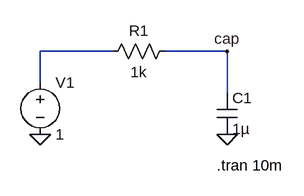
[diagram p0: schematic RC CIRCUIT.asc]
RC CIRCUIT.asc, the LTspice schematic file:
Version 4.1
SHEET 1 880 680
WIRE 176 96 64 96
WIRE 352 96 256 96
WIRE 64 144 64 96
WIRE 352 160 352 96
FLAG 64 224 0
FLAG 352 224 0
FLAG 352 96 cap
SYMBOL voltage 64 128 R0
WINDOW 123 0 0 Left 0
WINDOW 39 0 0 Left 0
SYMATTR InstName V1
SYMATTR Value 1
SYMBOL res 272 80 R90
WINDOW 0 0 56 VBottom 2
WINDOW 3 32 56 VTop 2
SYMATTR InstName R1
SYMATTR Value 1k
SYMBOL cap 336 160 R0
SYMATTR InstName C1
SYMATTR Value 1µ
TEXT 336 272 Left 2 !.tran 10m

The netlist it stands for:
* RC CIRCUIT.asc
V1 N001 0 1
R1 cap N001 1k
C1 cap 0 1µ
.tran 10m
.backanno
.end